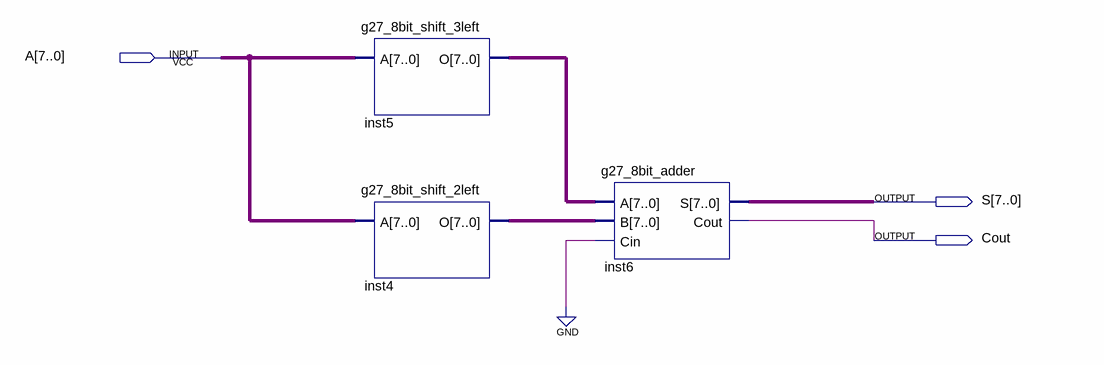
[diagram p0: schematic sheet]
// Quartus schematic testing.bdf as structural Verilog: 3 symbols, 3 pins
module testing (
  input  [7:0] A,
  output [7:0] S,
  output Cout
);

  wire [7:0] inst4_o, inst5_o;

  g27_8bit_shift_3left inst5 (.A(A), .O(inst5_o));
  g27_8bit_shift_2left inst4 (.A(A), .O(inst4_o));
  g27_8bit_adder inst6 (.A(inst5_o), .B(inst4_o), .Cin(1'b0), .S(S), .Cout(Cout));
endmodule
